# Altium schematic sheet Power.SchDoc
size A4; SheetNumber: 4; SheetTotal: 5
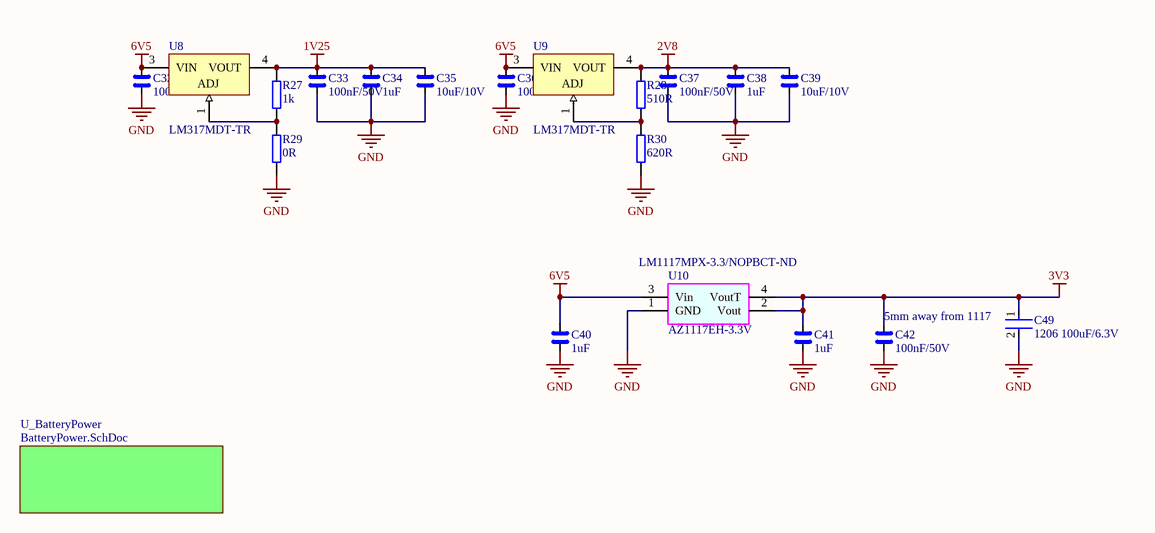
[diagram p0: Power.SchDoc]

## Parts
C32  100nF/50V  [1608[0603]]
C33  100nF/50V  [1608[0603]]
C34  1uF  [1608[0603]]
C35  10uF/10V  [1608[0603]]
C36  100nF/50V  [1608[0603]]
C37  100nF/50V  [1608[0603]]
C38  1uF  [1608[0603]]
C39  10uF/10V  [1608[0603]]
C40  1uF  [1608[0603]]
C41  1uF  [1608[0603]]
C42  100nF/50V  [1608[0603]]
C49  1206 100uF/6.3V  [FP-CL31-IPC_B]
R27  1k  [1608[0603]]
R28  510R  [1608[0603]]
R29  0R  [1608[0603]]
R30  620R  [1608[0603]]
U8  LM317MDT-TR  [TO-252_M]
U9  LM317MDT-TR  [TO-252_M]
U10  AZ1117EH-3.3V  Supplier Part Number 1: LM1117MPX-3.3/NOPBCT-ND  [SOT-223]

## Sub-sheets
U_BatteryPower = BatteryPower.SchDoc: no entries

## Nets
1V25: C33.1 C34.1 C35.1 R27.1 U8.4(VOUT)
2V8: C37.1 C38.1 C39.1 R28.1 U9.4(VOUT)
3V3: C41.1 C42.1 C49.1 U10.2(Vout) U10.4(VoutT)
6V5: C32.1 C36.1 C40.1 U8.3(VIN) U9.3(VIN) U10.3(Vin)
GND: C32.2 C33.2 C34.2 C35.2 C36.2 C37.2 C38.2 C39.2 C40.2 C41.2 C42.2 C49.2 R29.2 R30.2 U10.1(GND)
NetR27_2: R27.2 R29.1 U8.1(ADJ)
NetR28_2: R28.2 R30.1 U9.1(ADJ)

## Notes on the sheet
- (near C42) 5mm away from 1117

## Library data of the parts
C32 C33 C36 C37 C42 = C: Cap Ceramic 0.1uF 50V X7R 20% SMD 0603 125C Paper T/R; Supplier 1: Digi-Key; Supplier Part Number 1: 1276-1941-1-ND; Case/Package: 0603; LCSCPartNo: C14663
C34 C38 C40 C41 = C: CAP CER 1UF 10V X5R 0603; Supplier 1: Digi-Key; Supplier Part Number 1: 1276-1866-1-ND; Case/Package: 0603; LCSCPartNo: C15849
C35 C39 = C: Capacitor; Supplier 1: Digi-Key; Supplier Part Number 1: 1276-1096-1-ND; Case/Package: 0603; LCSCPartNo: C19702
C49 = CMP-13271-000821-1: Cap Ceramic 100uF 6.3V X5R ±20% SMD 1206 +85°C Embossed T/R; LCSCPartNo: C15008
R27-R30 = R: Res General Purpose Thick Film 0603 1% 1/10W ±100ppm/°C Molded SMD Paper T/R; Supplier 1: Digi-Key; Case/Package: 0603
  R27: LCSCPartNo: C21190
  R28: LCSCPartNo: C23193
  R29: LCSCPartNo: C21189
  R30: LCSCPartNo: C23220
U8 U9 = CMP-0244-00074-1: 500mA, Medium Current 1.2 to 37 V Adjustable Voltage Regulator, 3-Pin DPAK, Tape and Reel; Case/Package: DPAK; LCSCPartNo: C75510
U10 = AZ1117EH-3.3V: IC REG LIN 3.3V 800MA SOT223-4; Supplier 1: Digi-Key; Case/Package: SOT-223; LCSCPartNo: C6186